# Altium schematic sheet Sheet1.SchDoc
size A4; Author: Christian Kieser; Engineer: Christian Kieser
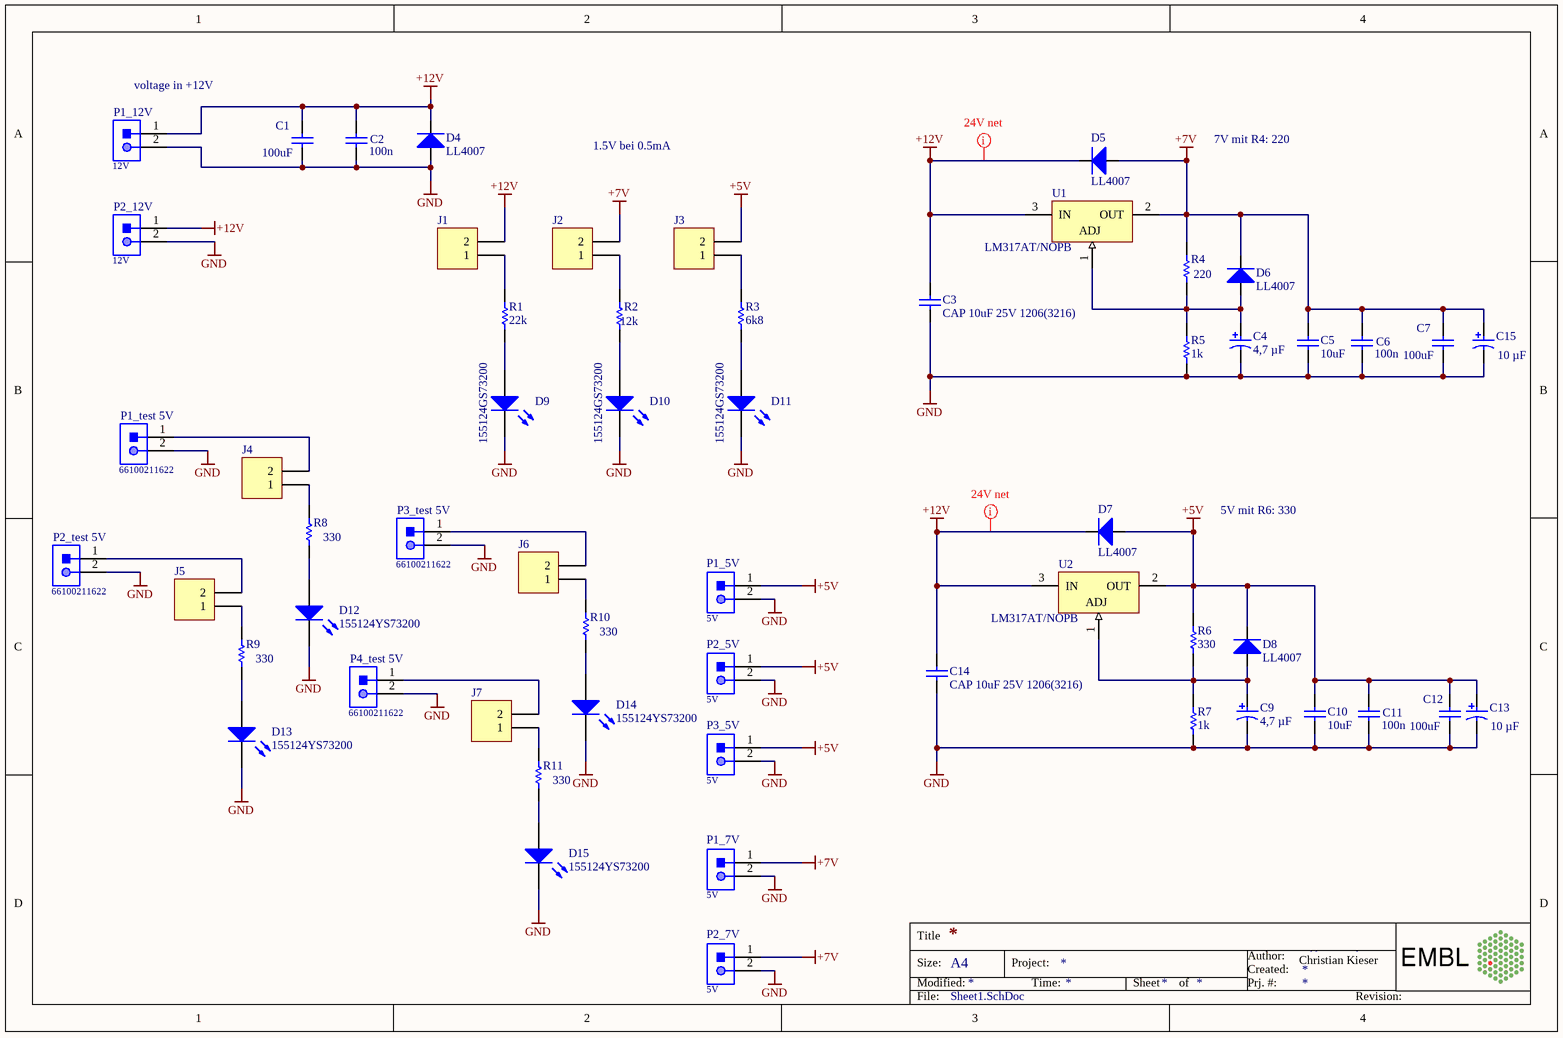
[diagram p0: Sheet1.SchDoc]

## Parts
C1  100uF  [CAPC1206(3216)190_L]
C2  100n  [CAPC2013X88X50ML20T25]
C3  CAP 10uF 25V 1206(3216)  [CAPC1206(3216)190_N]
C4  4,7 µF  [A Package]
C5  10uF  [CAPC1206(3216)190_N]
C6  100n  [CAPC2013X88X50ML20T25]
C7  100uF  [CAPC1206(3216)190_L]
C9  4,7 µF  [A Package]
C10  10uF  [CAPC1206(3216)190_N]
C11  100n  [CAPC2013X88X50ML20T25]
C12  100uF  [CAPC1206(3216)190_L]
C13  10 µF  [KEMT-520-D_Low]
C14  CAP 10uF 25V 1206(3216)  [CAPC1206(3216)190_N]
C15  10 µF  [KEMT-520-D_Low]
D4  LL4007  [LL4007]
D5  LL4007  [LL4007]
D6  LL4007  [LL4007]
D7  LL4007  [LL4007]
D8  LL4007  [LL4007]
D9  155124GS73200  [1204]
D10  155124GS73200  [1204]
D11  155124GS73200  [1204]
D12  155124YS73200  [1204]
D13  155124YS73200  [1204]
D14  155124YS73200  [1204]
D15  155124YS73200  [1204]
J1  61300211121  [61300211121]  (value not drawn)
J2  61300211121  [61300211121]  (value not drawn)
J3  61300211121  [61300211121]  (value not drawn)
J4  61300211121  [61300211121]  (value not drawn)
J5  61300211121  [61300211121]  (value not drawn)
J6  61300211121  [61300211121]  (value not drawn)
J7  61300211121  [61300211121]  (value not drawn)
P1_5V  5V  [66100211622]
P1_7V  5V  [66100211622]
P1_12V  12V  [66100211622]
P1_test_5V  66100211622  [66100211622]
P2_5V  5V  [66100211622]
P2_7V  5V  [66100211622]
P2_12V  12V  [66100211622]
P2_test_5V  66100211622  [66100211622]
P3_5V  5V  [66100211622]
P3_test_5V  66100211622  [66100211622]
P4_test_5V  66100211622  [66100211622]
R1  22k  [YAGO-RC0805_M]
R2  12k  [YAGO-RC0805_M]
R3  6k8  [YAGO-RC0805_M]
R4  220  [YAGO-RC0805_M]
R5  1k  [YAGO-RC0805_M]
R6  330  [YAGO-RC0805_M]
R7  1k  [YAGO-RC0805_M]
R8  330  [YAGO-RC0805_M]
R9  330  [YAGO-RC0805_M]
R10  330  [YAGO-RC0805_M]
R11  330  [YAGO-RC0805_M]
U1  LM317AT/NOPB  [NDE0003A]
U2  LM317AT/NOPB  [NDE0003A]

## Nets
+5V: C10.2 C11.2 C12.2 C13.1 D7.1(A) D8.2(K) J3.2 P1_5V.1 P2_5V.1 P3_5V.1 R6.2 U2.2(OUT)
+7V: C5.2 C6.2 C7.2 C15.1 D5.1(A) D6.2(K) J2.2 P1_7V.1 P2_7V.1 R4.2 U1.2(OUT)
+12V: C1.2 C2.2 C3.2 C14.2 D4.2(K) D5.2(K) D7.2(K) J1.2 P1_12V.1 P2_12V.1 U1.3(IN) U2.3(IN)
GND: C1.1 C2.1 C3.1 C4.2 C5.1 C6.1 C7.1 C9.2 C10.1 C11.1 C12.1 C13.2 C14.1 C15.2 D4.1(A) D9.1(K) D10.1(K) D11.1(K) D12.1(K) D13.1(K) D14.1(K) D15.1(K) P1_5V.2 P1_7V.2 P1_12V.2 P1_test_5V.2 P2_5V.2 P2_7V.2 P2_12V.2 P2_test_5V.2 P3_5V.2 P3_test_5V.2 P4_test_5V.2 R5.1 R7.1
NetC4_1: C4.1 D6.1(A) R4.1 R5.2 U1.1(ADJ)
NetC9_1: C9.1 D8.1(A) R6.1 R7.2 U2.1(ADJ)
NetD9_2: D9.2(A) R1.1
NetD10_2: D10.2(A) R2.1
NetD11_2: D11.2(A) R3.1
NetD12_2: D12.2(A) R8.1
NetD13_2: D13.2(A) R9.1
NetD14_2: D14.2(A) R10.1
NetD15_2: D15.2(A) R11.1
NetJ1_1: J1.1 R1.2
NetJ2_1: J2.1 R2.2
NetJ3_1: J3.1 R3.2
NetJ4_1: J4.1 R8.2
NetJ4_2: J4.2 P1_test_5V.1
NetJ5_1: J5.1 R9.2
NetJ5_2: J5.2 P2_test_5V.1
NetJ6_1: J6.1 R10.2
NetJ6_2: J6.2 P3_test_5V.1
NetJ7_1: J7.1 R11.2
NetJ7_2: J7.2 P4_test_5V.1

## Layout directives
net class 24V_net: +12V

## Notes on the sheet
- (near P1_12V) voltage in +12V
- 1.5V bei 0.5mA
- 7V mit R4: 220
- 5V mit R6: 330
- Christian Kieser
- Title
- Size:
- Modified:
- A4
- Project:
- Time:
- Sheet
- of
- Created:
- Author:
- Prj. #:
- Alfons Riedinger
- File:
- Revision:

## Library data of the parts
C1 C7 C12 = CMP-00469-2: CAP 100uF 6.3V ±20% 1206 (3216 Metric) Thickness 1.9mm SMD; PartNumber: 885012108005; Manufacturer: WURTH ELEKTRONIK; Tolerance: Â±20%; Case-EIA: 1206; Case-Metric: 3216; Technology: SMT; Max Thickness: 1.9 mm; Rated Voltage: 6.3 V; Value: 100uF; Supplier: Farnell; Supplier Part Number: 2495155; ComponentLink1Description: 2326302.pdf; ComponentLink1URL: http://www.farnell.com/cad/2326302.pdf; ComponentLink2Description: 1958456.pdf; ComponentLink2URL: http://www.farnell.com/datasheets/1958456.pdf; Manufacturer Part Number: 885012108005
C2 C6 C11 = CMP-001-0082-2: generic 0805 COG oder X7R Vielschichtkondensatoren max. +/-10%
C3 C5 C10 C14 = CMP-00471-2: CAP 10uF 25V -20% to +80% 1206 (3216 Metric) Thickness 1.9mm SMD; Manufacturer: Wurth Electronics Inc.; Manufacturer Part Number: 885012208069; PartNumber: 885 012 208 069; Case-EIA: 1206; Case-Metric: 3216; Temperature Coefficient: X7R; Value: 10uF; Tolerance: -20% to +80%; Max Thickness: 1.9 mm; Rated Voltage: 25 V; Technology: SMT; ComponentLink1Description: 885012208069.pdf; ComponentLink1URL: http://katalog.we-online.de/pbs/datasheet/885012208069.pdf; Mounting Type: Surface Mount, MLCC; Operating Temperature: -55°C ~ 125°C; Package / Case: 1206 (3216 Metric); Packaging: Tape & Reel (TR); Part Status: Active; Size / Dimension: 0.126" L x 0.063" W (3.20mm x 1.60mm); Supplier: Digi-Key; Supplier Part Number: 732-7574-2-ND; Thickness (Max): 0.075" (1.90mm)
C4 = CMP-001-0039-5: 4,7 µF; 6V; Gr. A; T491A475K006AT; Manufacturer: KEMET; Capacitance: 4.7µF; ESR (Equivalent Series Resistance): 6 Ohm; Lifetime @ Temp.: 2000 Hrs @ 85°C; Tolerance: ±10%; Type: Molded; Voltage - Rated: 6.3V; ComponentLink1Description: KEM_T2005_T491.pdf; ComponentLink1URL: http://www.kemet.com/Lists/ProductCatalog/Attachments/254/KEM_T2005_T491.pdf; Failure Rate: -; Features: General Purpose; Height - Seated (Max): 0.071" (1.80mm); Lead Spacing: -; Manufacturer Size Code: A; Mounting Type: Surface Mount; Operating Temperature: -55°C ~ 125°C; Package / Case: 1206 (3216 Metric); Packaging: Cut Tape (CT); Part Status: Active; Size / Dimension: 0.126" L x 0.063" W (3.20mm x 1.60mm); Supplier: Digi-Key; Supplier Part Number: 399-9717-1-ND; PartNumber: T491A475K006AT
C9 = CMP-001-0039-3: 4,7 µF; 6V; Gr. A; T491A475K006AT; Manufacturer: KEMET; Capacitance: 4.7µF; ESR (Equivalent Series Resistance): 6 Ohm; Lifetime @ Temp.: 2000 Hrs @ 85°C; Tolerance: ±10%; Type: Molded; Voltage - Rated: 6.3V; ComponentLink1Description: KEM_T2005_T491.pdf; ComponentLink1URL: http://www.kemet.com/Lists/ProductCatalog/Attachments/254/KEM_T2005_T491.pdf; Failure Rate: -; Features: General Purpose; Height - Seated (Max): 0.071" (1.80mm); Lead Spacing: -; Manufacturer Size Code: A; Mounting Type: Surface Mount; Operating Temperature: -55°C ~ 125°C; Package / Case: 1206 (3216 Metric); Packaging: Cut Tape (CT); Part Status: Active; Size / Dimension: 0.126" L x 0.063" W (3.20mm x 1.60mm); Supplier: Digi-Key; Supplier Part Number: 399-9717-1-ND; PartNumber: T491A475K006AT
C13 C15 = CMP-001-0033-3: 10 µF, 35V, 125 mOhm, Gr. D / partnumb: T495D106K035ATE125; Manufacturer: KEMET; Capacitance: 10µF; Lifetime @ Temp.: 2000 Hrs @ 85°C; Tolerance: ±10%; Type: Molded; ComponentLink1Description: docfinder?Partnumber=T495D106K035ATE300; ComponentLink1URL: http://www.kemet.com/docfinder?Partnumber=T495D106K035ATE300; ESR (Equivalent Series Resistance): 125 mOhm; Failure Rate: -; Features: General Purpose; Height - Seated (Max): 0.122" (3.10mm); Lead Spacing: -; Manufacturer Size Code: D; Mounting Type: Surface Mount; Operating Temperature: -55°C ~ 125°C; Package / Case: 2917 (7343 Metric); Packaging: Cut Tape (CT); Part Status: Active; Size / Dimension: 0.287" L x 0.169" W (7.30mm x 4.30mm); Supplier: Digi-Key; Supplier Part Number: 399-10292-1-ND; Voltage - Rated: 35V; PartNumber: T495D106K035ATE125
D4-D8 = CMP-001-0049-2: LL4007;  Vf 1,1V @ 1A, If = 1A; Manufacturer: TAIWAN SEMICONDUCTOR; PartNumber: LL4007G L2; Bauform - Diode: DO-213; Betriebstemperatur, max.: 175; Diodenkonfiguration: Einfach; Durchlassspannung Vf max.: 1.1; Durchlassstrom (mittlerer) If(AV): 1; Spitzendurchlassstrom Ifsm, max.: 25; SVHC: No SVHC (20-Jun-2016; Verpackung: Gurtabschnitt; Anzahl der Pins: -; ComponentLink1Description: 2182652.pdf; ComponentLink1URL: http://www.farnell.com/datasheets/2182652.pdf; Periodische Sperrspannung Vrrm, max.: 1; Produktpalette: -; Sperrerholzeit Trr, max.: -; Supplier: Farnell; Supplier Part Number: 2677381
D9-D11 = CMP-001-0164-1: Single Color LED, Green, Water Clear, 2mm; Viewing Angle: 120°; Shape: Rectangular; Number of Functions: 1; Overall Height: 1mm; Luminous Intensity-Nom: 600mcd; Forward Current-Max: 25mA; Max Operating Temperature: 85°C; RoHS Compliant: Yes; Number of Pins: 3; Packaging: Tape and Reel; REACH SVHC: Yes; Lens Style: WATER CLEAR; Mount: Surface Mount; Min Operating Temperature: -40°C; Color: Green; Size: 2mm; Optoelectronic Device Type: SINGLE COLOR LED
D12-D15 = CMP-00543-1: Single Color LED, Yellow, Water Clear, 2mm; Forward Current-Max: 25mA; Luminous Intensity-Nom: 130mcd; Viewing Angle: 120°; Shape: Rectangular; Number of Functions: 1; Overall Height: 1mm; RoHS Compliant: Yes; Lens Style: WATER CLEAR; REACH SVHC: Yes; Number of Pins: 3; Max Operating Temperature: 85°C; Mount: Surface Mount; Min Operating Temperature: -40°C; Optoelectronic Device Type: SINGLE COLOR LED; Packaging: Tape and Reel; Size: 2mm; Color: Yellow
J1-J7 = CMP-001-0071-2: 2Pol; gerade; WR-PHD 2.54 mm THT Pin Header; Manufacturer: Wurth Electronics; Voltage Rating: 250 V; Number of Positions: 2 Position; Current Rating: 3 A; Latching Type: Unlatched; Mating Post Length: 6 mm; Mounting Angle: Straight; Pitch: 2.54 mm; Insulation Resistance: 1 GOhms; Supplier: Mouser; Reeling: False; PartNumber: 61300211121; Flammability Rating: UL 94 V-0; Row Spacing: -; Contact Type: -; Type: Pin Strip; Application: Wire to Board; Manufacturer Part Number: 61300211121; RoHS - Mouser: Y; Standard Pack Qty: 1000; Housing Material: Polybutylene Terephthalate (PBT); Contact Material: Copper Alloy; Contact Plating: Gold; Accessory Type: -; Number of Rows: 1 Row; ComponentLink1URL: http://www.mouser.com/ds/2/445/6130xx11121-538006.pdf; Housing Gender: -; ComponentLink1Description: 6130xx11121-538006.pdf; Contact Gender: Pin (Male); Series: WR-PHD; Packaging: Bulk; Brand: Wurth Electronics; Termination Style: Through Hole; Minimum Order Quantity: 1; Termination Post Length: 3 mm; Product: Headers; Mounting Style: Straight Pin; Supplier Part Number: 710-61300211121
P1_5V P1_7V P1_12V P1_test_5V P2_5V P2_7V P2_12V P2_test_5V P3_5V P3_test_5V P4_test_5V = CMP-001-0161-A.3: WR-WTB 2.54 mm Male Vertical Shrouded Header 2 Pins; Manufacturer: Wurth Electronics; Supplier Part Number: 732-14102-ND; PartNumber: 66100211622; Supplier: Digi-Key
R1-R11 = CMP-001-0027-2: 0805 Yageo Standard BlackBox Resistors; Power (Watts): 0.125W, 1/8W; Temperature Coefficient: ±200ppm/°C; Tolerance: ±1%; ComponentLink1Description: PYu-RC_Group_51_RoHS_L_7.pdf; Part Status: Active; Size / Dimension: 0.079" L x 0.049" W (2.00mm x 1.25mm); Supplier Device Package: 0805; ComponentLink1URL: http://www.yageo.com/documents/recent/PYu-RC_Group_51_RoHS_L_7.pdf; Composition: Thick Film; Failure Rate: -; Features: Moisture Resistant; Height - Seated (Max): 0.024" (0.60mm); Manufacturer: Yageo; Operating Temperature: -55°C ~ 155°C; Package / Case: 0805 (2012 Metric); Packaging: Digi-Reel®
U1 U2 = CMP-00535-1: 3-Terminal Adjustable Regulator, 3-pin TO-220, Pb-Free; Manufacturer: Texas Instruments; CompType: LDO IC; PackageTopMarking: NSUZXYTTE#*LM317AT P+; PowerWise: N; ComponentLink1URL: http://www.ti.com/general/docs/lit/getliterature.tsp?genericPartNumber=LM317-N&fileType=pdf; RoHS: Y; PackageDescription: TO-220, Molded, 3 Lead, Straight; ComponentLink1Description: Datasheet URL; PackageReference: NDE0003A; PinCount: 3